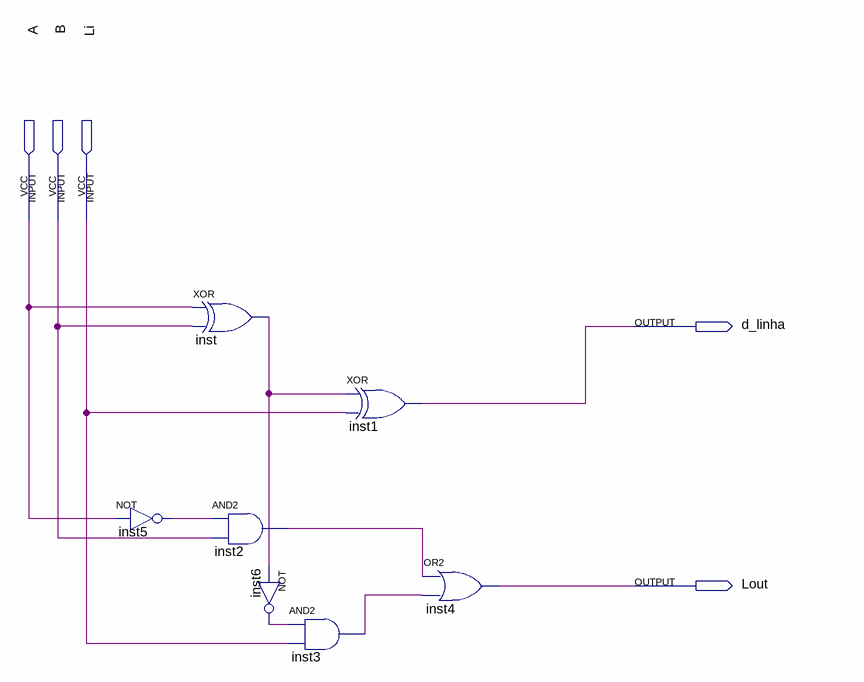
[diagram p0: schematic sheet]
// Quartus schematic subtrator.bdf as structural Verilog: 7 symbols, 5 pins
module subtrator (
  input  A,
  input  B,
  input  Li,
  output d_linha,
  output Lout
);

  wire inst2_out, inst3_out, inst5_out, inst6_out, inst_out;

  not inst5 (inst5_out, A);
  xor inst (inst_out, A, B);
  and inst2 (inst2_out, inst5_out, B);
  not inst6 (inst6_out, inst_out);
  xor inst1 (d_linha, inst_out, Li);
  and inst3 (inst3_out, inst6_out, Li);
  or inst4 (Lout, inst2_out, inst3_out);
endmodule
